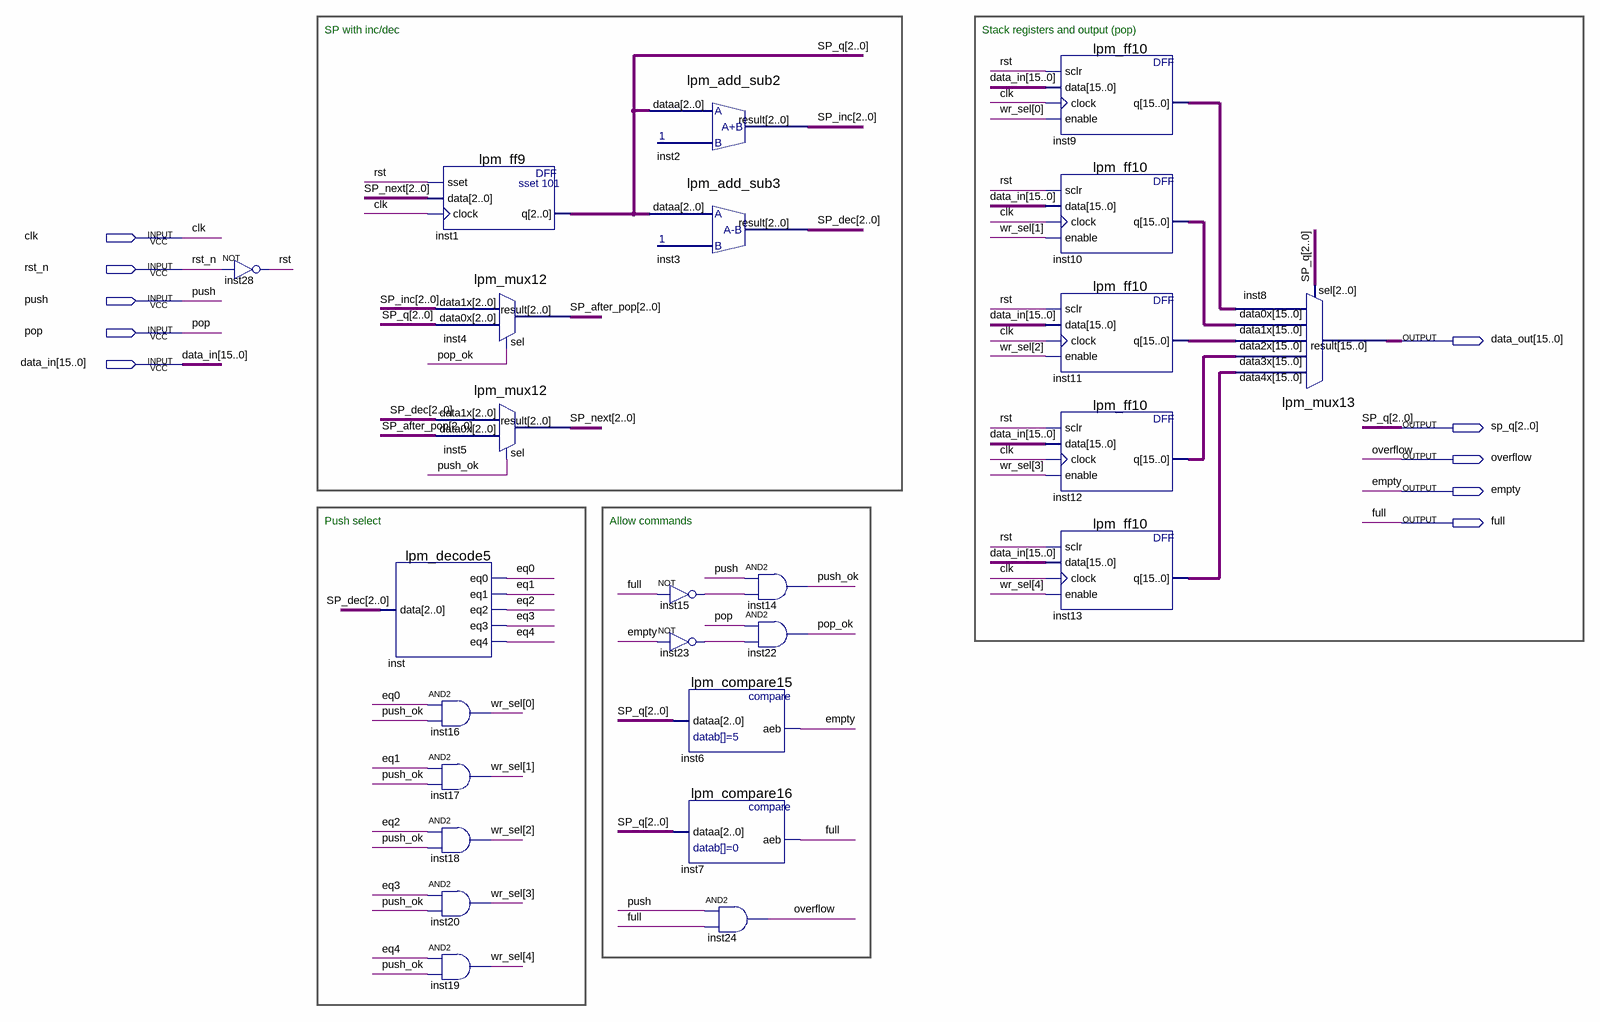
[diagram p0: schematic sheet]
// Quartus schematic STACK.bdf as structural Verilog: 25 symbols, 10 pins
module STACK (
  input  clk,
  input  rst_n,
  input  push,
  input  pop,
  input  [15:0] data_in,
  output [15:0] data_out,
  output [2:0] sp_q,
  output overflow,
  output empty,
  output full
);

  wire eq0, eq1, eq2, eq3, eq4, inst15_out, inst23_out, pop_ok, push_ok, rst;
  wire [2:0] SP_after_pop, SP_dec, SP_inc, SP_next;
  wire [4:0] wr_sel;
  wire [15:0] inst9_q, inst10_q, inst11_q, inst12_q, inst13_q;

  not inst28 (rst, rst_n);
  lpm_decode5 inst (.data(SP_dec), .eq0(eq0), .eq1(eq1), .eq2(eq2), .eq3(eq3), .eq4(eq4));
  lpm_ff9 inst1 (.sset(rst), .data(SP_next), .clock(clk), .q(sp_q));
  lpm_mux12 inst4 (.data1x(SP_inc), .data0x(sp_q), .sel(pop_ok), .result(SP_after_pop));
  lpm_mux12 inst5 (.data1x(SP_dec), .data0x(SP_after_pop), .sel(push_ok), .result(SP_next));
  and inst16 (wr_sel[0], eq0, push_ok);
  and inst17 (wr_sel[1], eq1, push_ok);
  and inst18 (wr_sel[2], eq2, push_ok);
  and inst20 (wr_sel[3], eq3, push_ok);
  and inst19 (wr_sel[4], eq4, push_ok);
  lpm_add_sub2 inst2 (.dataa(sp_q), .result(SP_inc));
  lpm_add_sub3 inst3 (.dataa(sp_q), .result(SP_dec));
  not inst15 (inst15_out, full);
  not inst23 (inst23_out, empty);
  lpm_compare15 inst6 (.dataa(sp_q), .aeb(empty));
  lpm_compare16 inst7 (.dataa(sp_q), .aeb(full));
  and inst24 (overflow, push, full);
  and inst14 (push_ok, push, inst15_out);
  and inst22 (pop_ok, pop, inst23_out);
  lpm_ff10 inst9 (.sclr(rst), .data(data_in), .clock(clk), .enable(wr_sel[0]), .q(inst9_q));
  lpm_ff10 inst10 (.sclr(rst), .data(data_in), .clock(clk), .enable(wr_sel[1]), .q(inst10_q));
  lpm_ff10 inst11 (.sclr(rst), .data(data_in), .clock(clk), .enable(wr_sel[2]), .q(inst11_q));
  lpm_ff10 inst12 (.sclr(rst), .data(data_in), .clock(clk), .enable(wr_sel[3]), .q(inst12_q));
  lpm_ff10 inst13 (.sclr(rst), .data(data_in), .clock(clk), .enable(wr_sel[4]), .q(inst13_q));
  lpm_mux13 inst8 (
    .data4x(inst13_q), .data3x(inst12_q), .data2x(inst11_q), .data1x(inst10_q), .data0x(inst9_q), .sel(sp_q),
    .result(data_out));

  // Notes on the sheet:
  //   SP with inc/dec
  //   Stack registers and output (pop)
  //   Push select
  //   Allow commands
endmodule
